# Altium schematic sheet Sheet2.SchDoc: Оконечное устройство
size 420 x 297 mm; ApprovedBy: Алексеев; CheckedBy: Богданов; Author: Пятиренко; DocumentNumber: ЭАЕСН.464512.002Э4; SheetNumber: 1; SheetTotal: 1; PERVICH PRIM: ЭАЕСН.464512.002Э4; Title2: Схема электрических соединений; PageSetup: Record=PageOptions|CenterHorizontal=True|CenterVertical=True|PrintScale=0.98|XCorrection=1.00|YCorrection=1.00|PrintKind=1|BorderSize=5000000|LeftOffset=0|BottomOffset=0|Orientation=2|PaperLength=1000|PaperWidth=1000|Scale=100|PaperSource=7|PrintQuality=600|MediaType=1|DitherType=10|PrintScaleMode=1|PaperKind=A3|PaperIndex=8
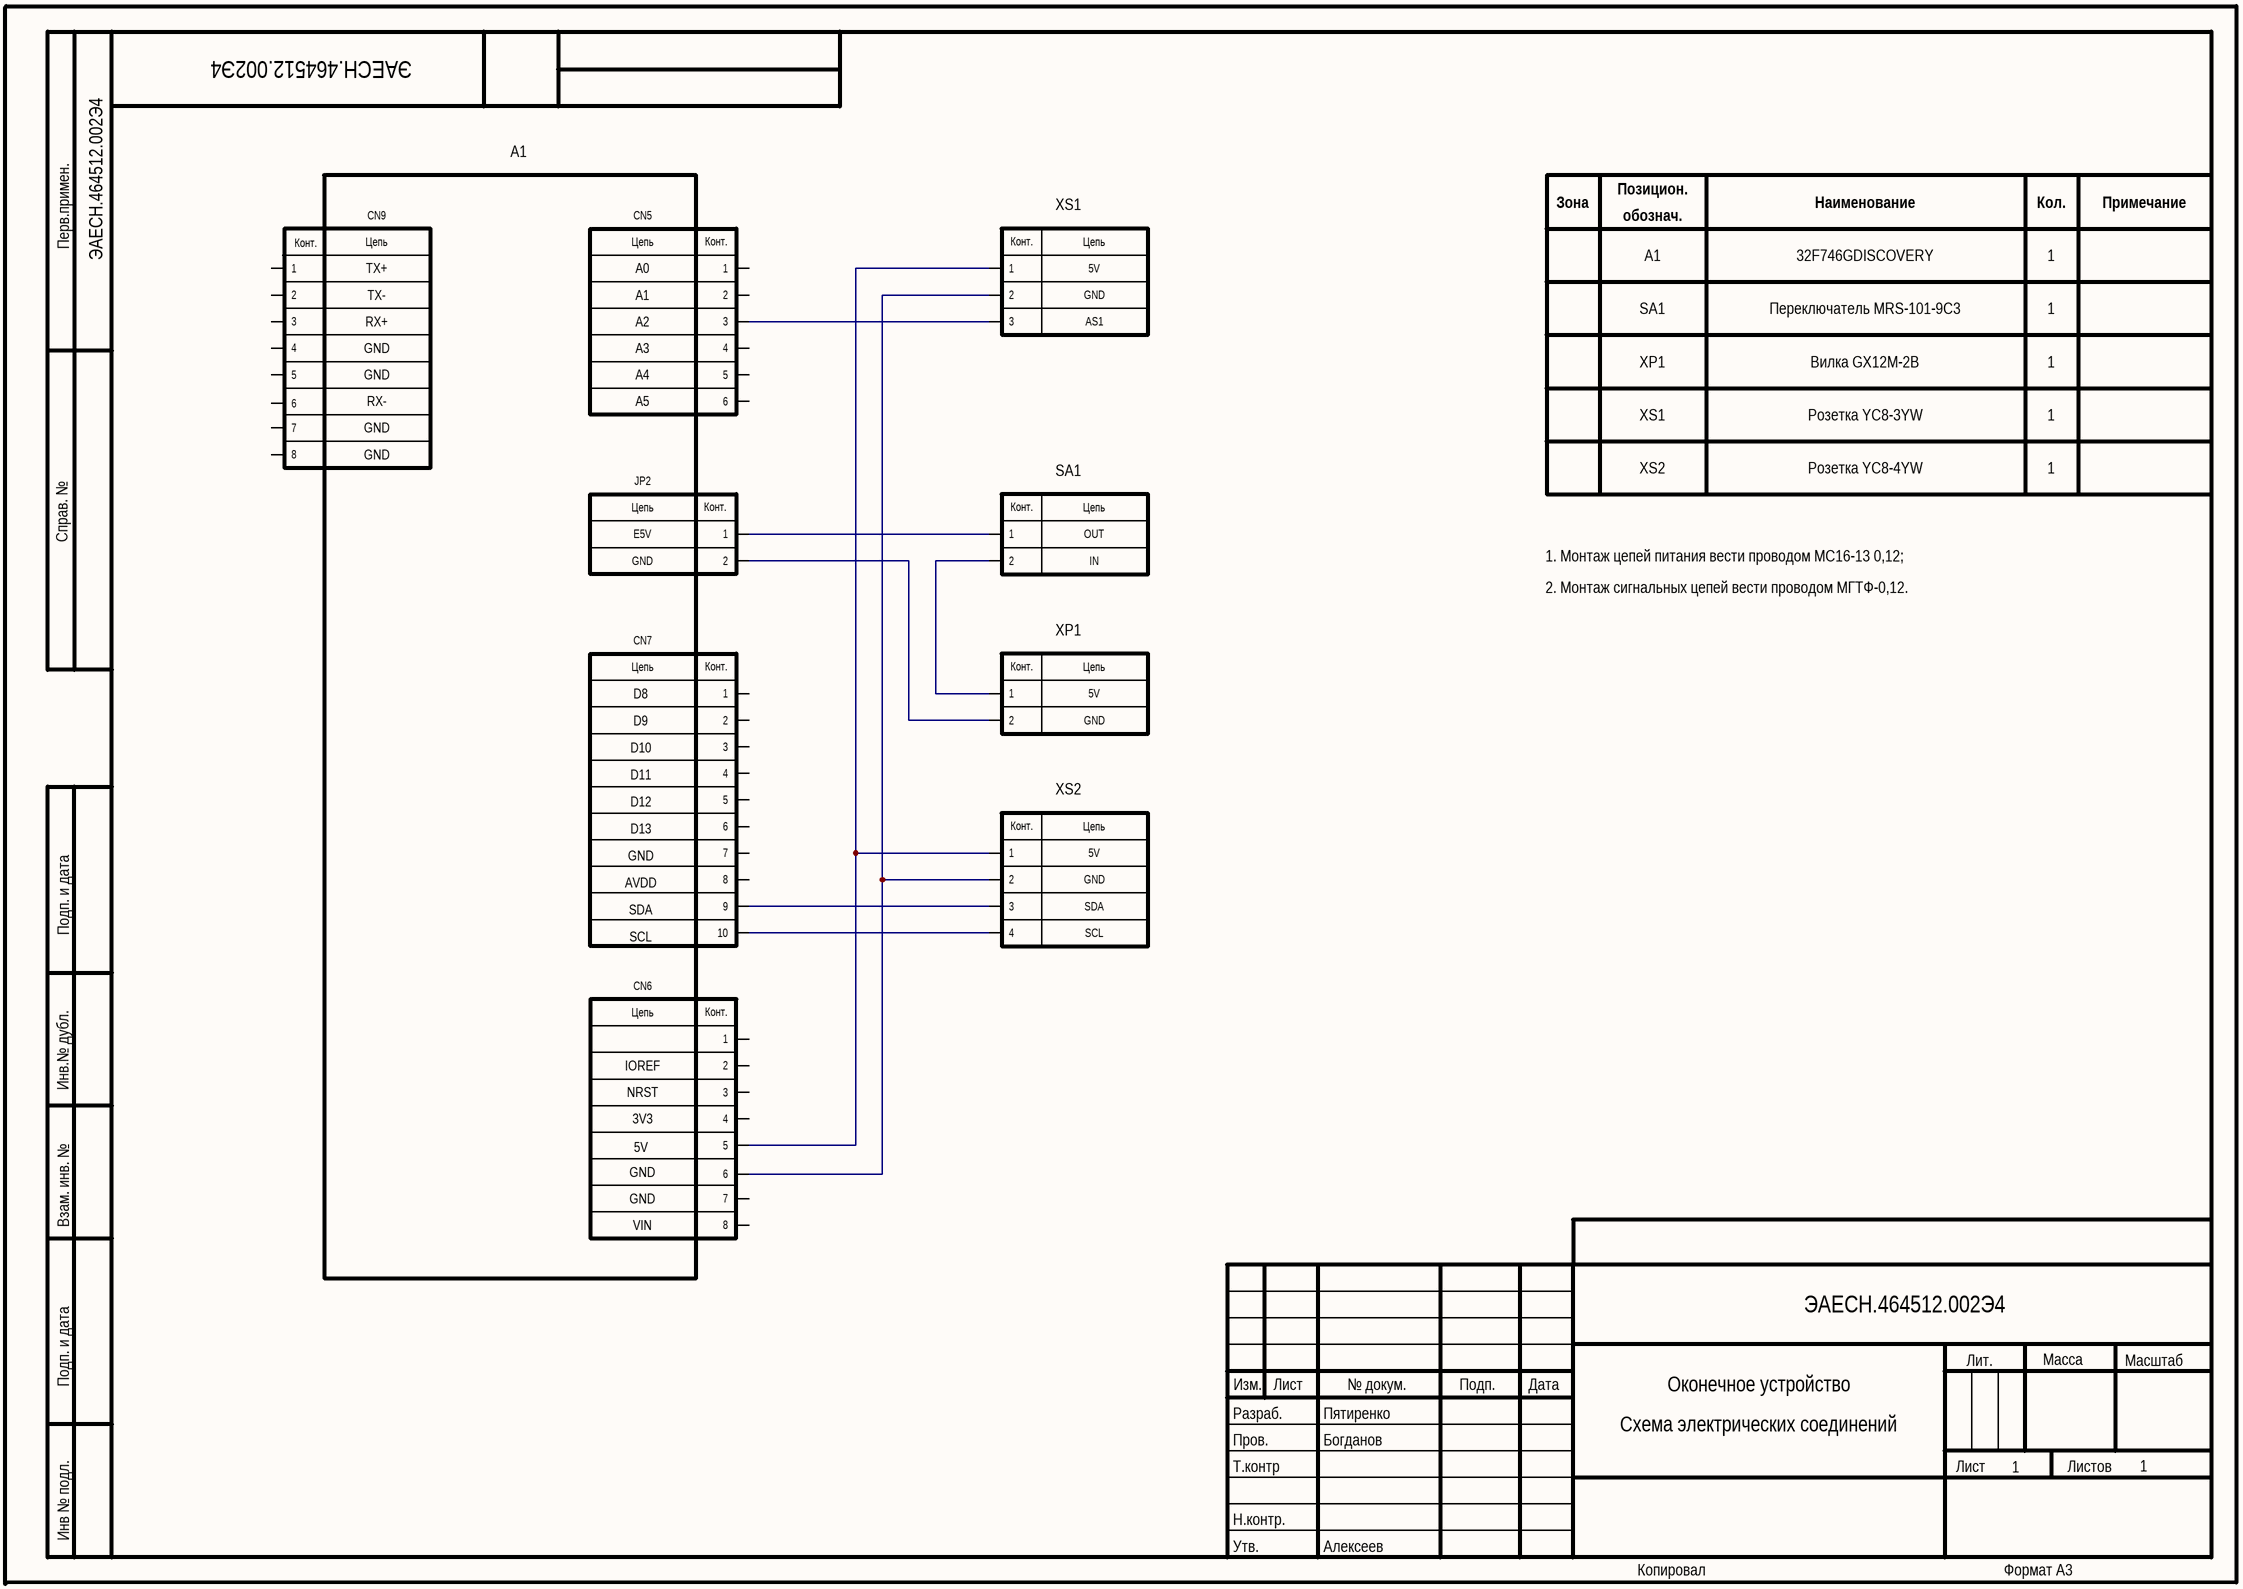
[diagram p0: Sheet2.SchDoc]

## Parts
A1  32F746GDISCOVERY  (value not drawn)
SA1  MRS-101-9C3  (value not drawn)
XP1  GX12M-2B  (value not drawn)
XS1  YC8-3YW  (value not drawn)
XS2  YC8-4YW  (value not drawn)

## Nets
NetA1_1: A1.1 SA1.1
NetA1_2: A1.2 XP1.2
NetA1_3: A1.3 XS1.3
NetA1_5: A1.5 XS1.1 XS2.1
NetA1_6: A1.6 XS1.2 XS2.2
NetA1_9: A1.9 XS2.3
NetA1_10: A1.10 XS2.4
NetSA1_2: SA1.2 XP1.1

Not connected (* = marked no-connect by the designer): A1 4 7 8

## Notes on the sheet
- Позицион.
- (near A1) CN9
- (near A1) CN5
- Зона
- обознач.
- A1
- Наименование
- 32F746GDISCOVERY
- Кол.
- 1
- Примечание
- AS1
- 5V
- GND
- SA1
- Переключатель MRS-101-9C3
- XP1
- Вилка GX12M-2B
- XS1
- XS2
- Розетка YC8-3YW
- Розетка YC8-4YW
- (near A1) JP2
- OUT
- IN
- 1. Монтаж цепей питания вести проводом МС16-13 0,12;
- 2. Монтаж сигнальных цепей вести проводом МГТФ-0,12.
- (near A1) CN7
- SDA
- SCL
- (near A1) CN6
- Перв.примен.
- Справ. №
- Подп. и дата
- Инв.№ дубл.
- Взам. инв. №
- Изм.
- Лист
- № докум.
- Подп.
- Дата
- Лит.
- Масса
- Масштаб
- Пров.
- Т.контр
- Разраб.
- Листов
- Инв № подл.
- Н.контр.
- Утв.
- Копировал
- Формат А3
- (in symbol 32F746GDISCOVERY) Конт.; Цепь; TX+; A0; TX-; RX+; A2; GND; A3; A4; RX-; A5; E5V; D8; D9; D10; D11; D12; D13; AVDD; SDA; SCL; IOREF; NRST; 3V3; 5V; VIN
- (in symbol GX12M-2B) Конт.; Цепь
- (in symbol MRS-101-9C3) Конт.; Цепь
- (in symbol YC8-3YW) Конт.; Цепь
- (in symbol YC8-4YW) Конт.; Цепь